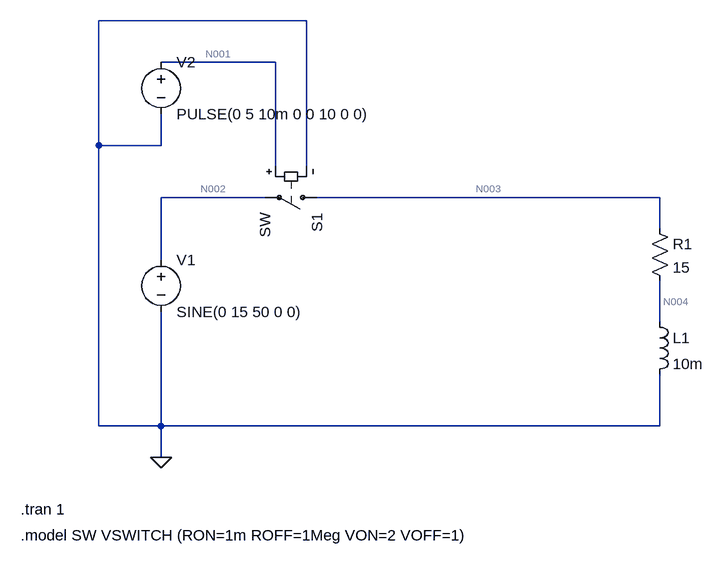
[diagram p0: schematic noise-gen-v1.asc]
noise-gen-v1.asc, the LTspice schematic file:
Version 4.1
SHEET 1 880 680
WIRE 160 -192 -160 -192
WIRE 112 -128 -64 -128
WIRE -160 0 -160 -192
WIRE -64 0 -64 -48
WIRE -64 0 -160 0
WIRE 112 32 112 -128
WIRE 160 32 160 -192
WIRE 96 80 -64 80
WIRE 704 80 176 80
WIRE 704 128 704 80
WIRE -64 176 -64 80
WIRE 704 272 704 208
WIRE -160 432 -160 0
WIRE -64 432 -64 256
WIRE -64 432 -160 432
WIRE 704 432 704 352
WIRE 704 432 -64 432
WIRE -64 480 -64 432
FLAG -64 480 0
SYMBOL voltage -64 160 R0
WINDOW 123 0 0 Left 0
WINDOW 39 0 0 Left 0
SYMATTR InstName V1
SYMATTR Value SINE(0 15 50 0 0)
SYMBOL sw 192 80 R90
SYMATTR InstName S1
SYMBOL voltage -64 -144 R0
WINDOW 123 0 0 Left 0
WINDOW 39 0 0 Left 0
SYMATTR InstName V2
SYMATTR Value PULSE(0 5 10m 0 0 10 0 0)
SYMBOL res 688 112 R0
SYMATTR InstName R1
SYMATTR Value 15
SYMBOL ind 688 256 R0
SYMATTR InstName L1
SYMATTR Value 10m
TEXT -280 560 Left 2 !.tran 1
TEXT -280 600 Left 2 !.model SW VSWITCH (RON=1m ROFF=1Meg VON=2 VOFF=1)

The netlist it stands for:
* noise-gen-v1.asc
V1 N002 0 SINE(0 15 50 0 0)
S1 N003 N002 N001 0 SW
V2 N001 0 PULSE(0 5 10m 0 0 10 0 0)
R1 N003 N004 15
L1 N004 0 10m
.tran 1
.model SW VSWITCH (RON=1m ROFF=1Meg VON=2 VOFF=1)
.backanno
.end

* Results of the author's LTspice run, read from the files saved beside the schematic
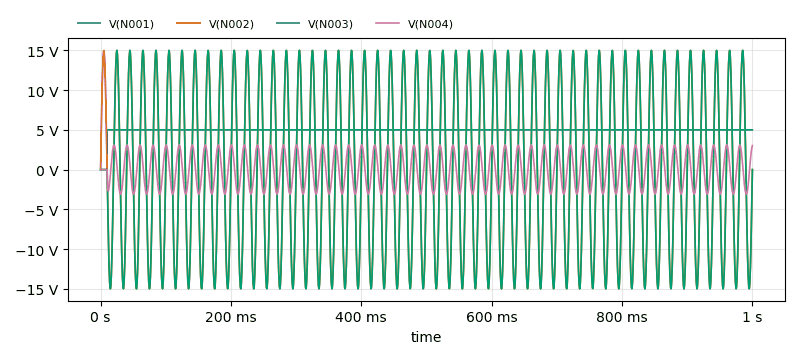
[diagram p1: Transient Analysis of noise-gen-v1.asc, plotted from the saved traces]
* Transient Analysis, 1 run:
*   V(N001): min 0 V, max 5 V, average 4.95 V, rms 4.975 V, last 5 V
*   V(N002): min -15 V, max 15 V, average -33.18 µV, rms 10.62 V, last 0 V
*   V(N003): min -15 V, max 15 V, average -94.92 mV, rms 10.57 V, last 201.8 µV
*   V(N004): min -3.098 V, max 3.098 V, average -2.025 mV, rms 2.174 V, last 3.028 V